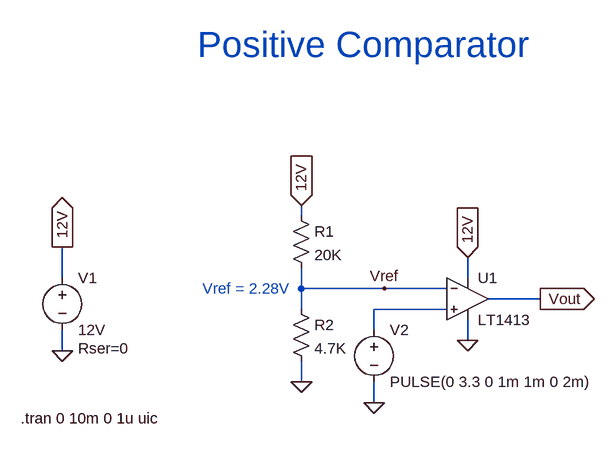
[diagram p0: schematic Op-Amp Positive Comparator.asc]
Op-Amp Positive Comparator.asc, the LTspice schematic file:
Version 4.1
SHEET 1 880 680
WIRE -16 48 -16 32
WIRE -384 144 -384 96
WIRE 240 144 240 112
WIRE -16 160 -16 128
WIRE 112 160 -16 160
WIRE 208 160 112 160
WIRE 352 176 272 176
WIRE -16 192 -16 160
WIRE 208 192 96 192
WIRE 96 224 96 192
WIRE 240 240 240 208
WIRE -384 256 -384 224
WIRE -16 304 -16 272
WIRE 96 336 96 304
FLAG -384 96 12V
IOPIN -384 96 Out
FLAG -384 256 0
FLAG 240 112 12V
IOPIN 240 112 In
FLAG 240 240 0
FLAG 96 336 0
FLAG -16 32 12V
IOPIN -16 32 In
FLAG -16 304 0
FLAG 112 160 Vref
FLAG 352 176 Vout
IOPIN 352 176 Out
SYMBOL OpAmps\\LT1413 240 112 R0
SYMATTR InstName U1
SYMBOL voltage -384 128 R0
WINDOW 123 0 0 Left 0
WINDOW 39 24 124 Left 2
SYMATTR InstName V1
SYMATTR Value 12V
SYMATTR SpiceLine Rser=0
SYMBOL voltage 96 208 R0
WINDOW 123 0 0 Left 0
WINDOW 39 0 0 Left 0
SYMATTR InstName V2
SYMATTR Value PULSE(0 3.3 0 1m 1m 0 2m)
SYMBOL res -32 32 R0
SYMATTR InstName R1
SYMATTR Value 20K
SYMBOL res -32 176 R0
SYMATTR InstName R2
SYMATTR Value 4.7K
TEXT -168 160 Left 2 ;Vref = 2.28V
TEXT -176 -216 Left 5 ;Positive Comparator
TEXT -448 360 Left 2 !.tran 0 10m 0 1u uic

The netlist it stands for:
* Op-Amp Positive Comparator.asc
X§U1 N001 Vref 12V 0 Vout LT1413  ; pins In+ In- V+ V- OUT
V1 12V 0 12V Rser=0
V2 N001 0 PULSE(0 3.3 0 1m 1m 0 2m)
R1 12V Vref 20K
R2 Vref 0 4.7K
* Vref = 2.28V
* Positive Comparator
.tran 0 10m 0 1u uic
.lib LTC.lib
.backanno
.end